# Altium schematic sheet USBHS_TYPEC.SchDoc: USB HS Type-C
size A4; Date: Not used; ApprovedBy: Not used; CheckedBy: Not used; Author: Not used; CompanyName: STMicroelectronics; DrawnBy: Not used; Engineer: Not used; Organization: Not used; Address1: Not used; Address2: Not used; Address3: Not used; Address4: Not used; DocumentNumber: Not used; Revision: Not used; SheetNumber: 9; SheetTotal: 16; CurrentTime: Not used; CurrentDate: Not used; Time: Not used; DocumentFullPathAndName: Not used; DocumentName: Not used; ModifiedDate: Not used; ImagePath: Not used; ProjectName: Not used; Application_BuildNumber: Not used
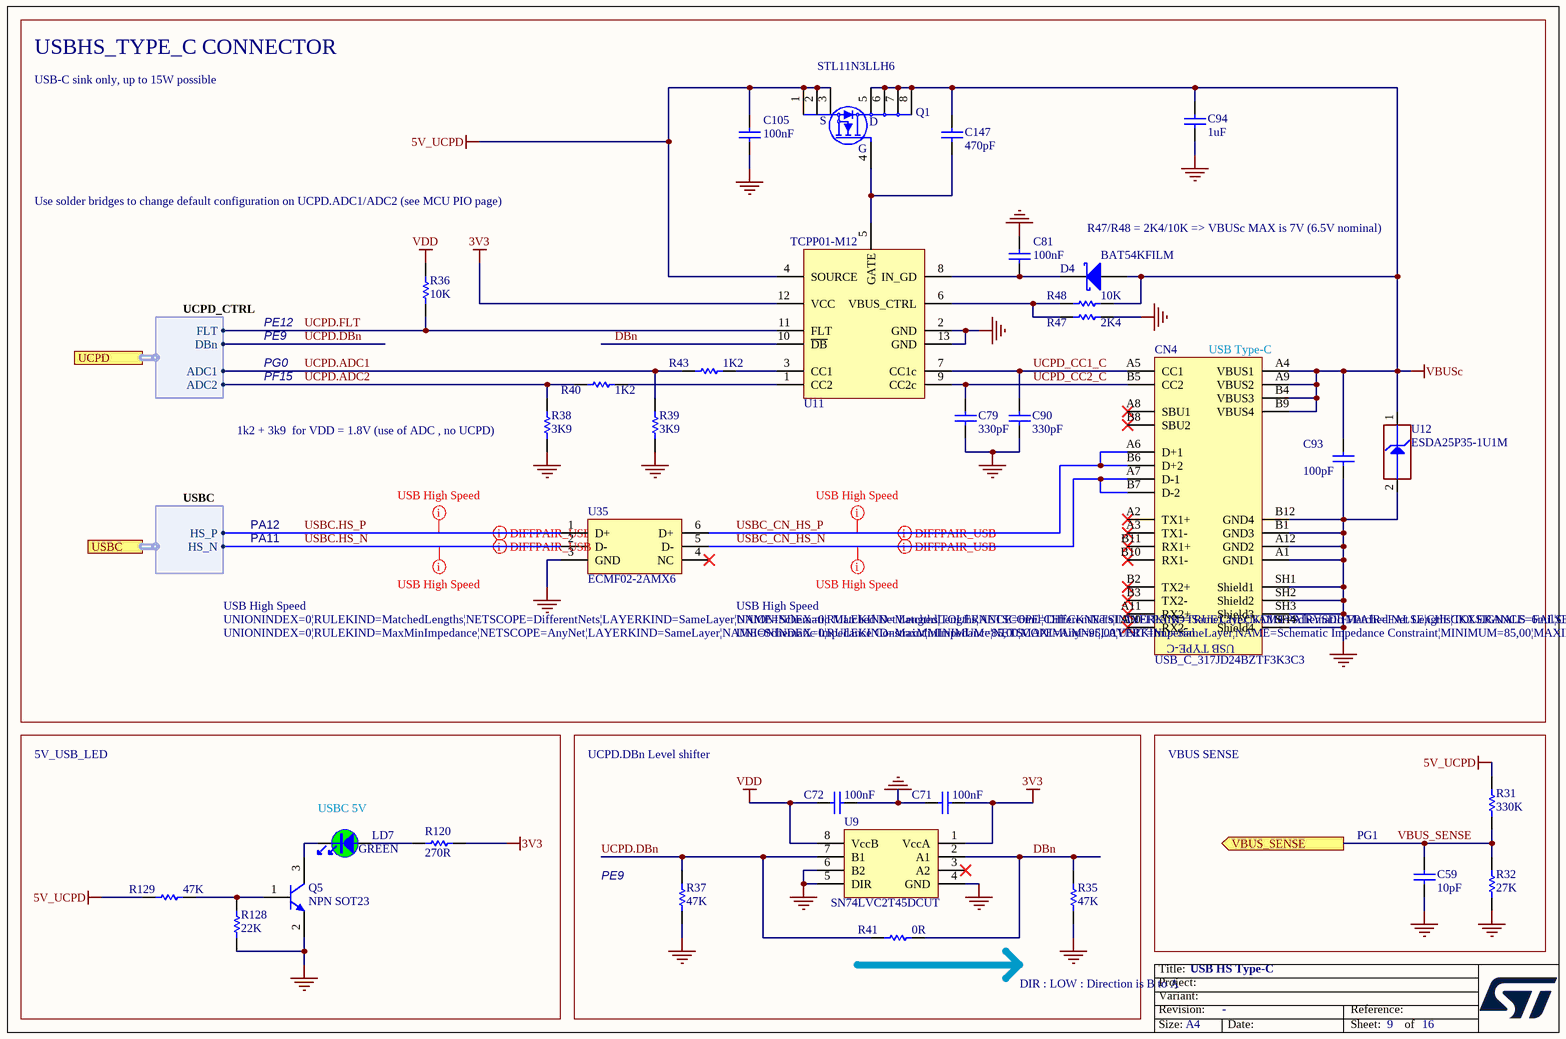
[diagram p0: USBHS_TYPEC.SchDoc]

## Parts
C59  value 10pF  [C0603]  (hidden comment: Capacitor)
C71  value 100nF  [C0402]  (hidden comment: Capacitor)
C72  value 100nF  [C0402]  (hidden comment: Capacitor)
C79  value 330pF  [C0402]  (hidden comment: Capacitor)
C81  value 100nF  [C0603]  (hidden comment: Capacitor)
C90  value 330pF  [C0402]  (hidden comment: Capacitor)
C93  value 100pF  [C0402]  (hidden comment: Capacitor)
C94  value 1uF  [C0402]  (hidden comment: Capacitor)
C105  value 100nF  [C0603]  (hidden comment: Capacitor)
C147  value 470pF  [C0402]  (hidden comment: Capacitor)
CN4  value USB_C_317JD24BZTF3K3C3  [CON_USB-TYPEC_COXOC_317JD24BZTF3K3C3]  (hidden comment: USB_TYPE_C_Receptacle_317JD24BZTF3K3C3)
D4  value BAT54KFILM  [DIO_SOD523_1A_2K]  (hidden comment: SCHOTTKY_1A_2K)
LD7  value GREEN  [LED_0603_OSRAM_LG-Q396-PS-35_GREEN_1A2K_H0P4]  (hidden comment: LED_green)
Q1  STL11N3LLH6  [MOS_POWERFLAT_3P3X3P3_P065]
Q5  value NPN SOT23  [NPN_SOT23]  (hidden comment: 9013-SOT23)
R31  value 330K  [R0603]  (hidden comment: Resistor)
R32  value 27K  [R0603]  (hidden comment: Resistor)
R35  value 47K  [R0603]  (hidden comment: Resistor)
R36  value 10K  [R0603]  (hidden comment: Resistor)
R37  value 47K  [R0603]  (hidden comment: Resistor)
R38  value 3K9  [R0402]  (hidden comment: Resistor)
R39  value 3K9  [R0402]  (hidden comment: Resistor)
R40  value 1K2  [R0402]  (hidden comment: Resistor)
R41  value 0R  [R0402]  (hidden comment: Resistor)
R43  value 1K2  [R0402]  (hidden comment: Resistor)
R47  value 2K4  [R0402]  (hidden comment: Resistor)
R48  value 10K  [R0402]  (hidden comment: Resistor)
R120  value 270R  [R0402]  (hidden comment: Resistor)
R128  value 22K  [R0603]  (hidden comment: Resistor)
R129  value 47K  [R0603]  (hidden comment: Resistor)
U9  SN74LVC2T45DCUT  [ICC_VSSOP8_DCU_R-PDSO-G8_2X2P30_P050]
U11  TCPP01-M12  [ICC_QFN12L-EPAD_3X3_P050]
U12  value ESDA25P35-1U1M  [ESD_QFN1610_2N_1K_2A]  (hidden comment: ESD-TRANSIL)
U35  ECMF02-2AMX6  [ESD_QFN-6L_1P7X1P5_P050]

## Blocks framed on the sheet
USBHS_TYPE_C CONNECTOR: C79 C81 C90 C93 C94 C105 C147 CN4 D4 Q1 R36 R38-R40 R43 R47 R48 U11 U12 U35

## Ports
UCPD (harness UCPD_CTRL), USBC (harness USBC), VBUS_SENSE (out)

## Harnesses
USBC: HS_P, HS_N
UCPD_CTRL: FLT, DBn, ADC1, ADC2

## Nets
3V3: C71.2 R120.2 U9.1(VccA) U11.12(VCC)
5V_UCPD: C105.1 Q1.1(S) Q1.2(S) Q1.3(S) R31.2 R129.1 U11.4(SOURCE)
GND: C59.1 C71.1 C72.2 C79.1 C81.1 C90.1 C93.1 C94.1 C105.2 CN4.A1(GND1) CN4.A12(GND2) CN4.B1(GND3) CN4.B12(GND4) CN4.SH1(Shield1) CN4.SH2(Shield2) CN4.SH3(Shield3) CN4.SH4(Shield4) Q5.2(E) R32.1 R35.1 R37.2 R38.1 R39.1 R47.2 R128.1 U9.4(GND) U9.5(DIR) U9.6(B2) U11.2(GND) U11.13(GND) U12.2(GND) U35.3(GND)
VBUSc: C93.2 C94.2 C147.2 CN4.A4(VBUS1) CN4.A9(VBUS2) CN4.B4(VBUS3) CN4.B9(VBUS4) D4.1(A) Q1.5(D) Q1.6(D) Q1.7(D) Q1.8(D) R48.2 U12.1(IO1)
VDD: C72.1 R36.2 U9.8(VccB)
DBn: R35.2 R41.2 U9.2(A1) U11.10(~{DB})
UCPD.ADC1: R39.2 R43.1 ; port UCPD.ADC1
UCPD.ADC2: R38.2 R40.1 ; port UCPD.ADC2
UCPD.DBn: R37.1 R41.1 U9.7(B1) ; port UCPD.DBn
UCPD.FLT: R36.1 U11.11(FLT) ; port UCPD.FLT
UCPD_CC1_C: C90.2 CN4.A5(CC1) U11.7(CC1c)
UCPD_CC2_C: C79.2 CN4.B5(CC2) U11.9(CC2c)
USBC.HS_N: U35.2(D-) ; port USBC.HS_N
USBC.HS_P: U35.1(D+) ; port USBC.HS_P
USBC_CN_HS_N: CN4.A7(D-1) CN4.B7(D-2) U35.5(D-)
USBC_CN_HS_P: CN4.A6(D+1) CN4.B6(D+2) U35.6(D+)
VBUS_SENSE: C59.2 R31.1 R32.2 ; port VBUS_SENSE
NetC81_2: C81.2 D4.2(K) U11.8(IN_GD)
NetC147_1: C147.1 Q1.4(G) U11.5(GATE)
NetLD7_1: LD7.1 R120.1
NetLD7_2: LD7.2 Q5.3(C)
NetQ5_1: Q5.1(B) R128.2 R129.2
NetR40_2: R40.2 U11.1(CC2)
NetR43_2: R43.2 U11.3(CC1)
NetR47_1: R47.1 R48.1 U11.6(VBUS_CTRL)

Not connected (* = marked no-connect by the designer): CN4 A2(TX1+)* A3(TX1-)* A8(SBU1)* A10(RX2-)* A11(RX2+)* B2(TX2+)* B3(TX2-)* B8(SBU2)* B10(RX1-)* B11(RX1+)*; U9 3(A2)*; U35 4(NC)*

## Layout directives
differential pair; rule Impedance Constraint [Min = 85.00    Max = 95.00    ]: USBC.HS_N, USBC.HS_P, USBC_CN_HS_N, USBC_CN_HS_P
rule Matched Net Lengths [Tolerance = 6mil]; rule Routing Layers [TopLayer - Enabled BottomLayer - Enabled ]; rule Impedance Constraint [Min = 85.00    Max = 95.00    ]; net class USB High Speed: USBC.HS_P, USBC_CN_HS_P
rule Matched Net Lengths [Tolerance = 0mil]; rule Routing Layers [TopLayer - Enabled BottomLayer - Enabled ]; rule Impedance Constraint [Min = 85.00    Max = 95.00    ]; net class USB High Speed: USBC.HS_N, USBC_CN_HS_N

## Notes on the sheet
- USB-C sink only, up to 15W possible
- Use solder bridges to change default configuration on UCPD.ADC1/ADC2 (see MCU PIO page)
- (near D4) R47/R48 = 2K4/10K => VBUSc MAX is 7V (6.5V nominal)
- PG0
- PF15
- PE12
- PE9
- (near CN4) USB Type-C
- (near R38) 1k2 + 3k9  for VDD = 1.8V (use of ADC , no UCPD)
- PA12
- PA11
- 5V_USB_LED
- UCPD.DBn Level shifter
- VBUS SENSE
- (near LD7) USBC 5V
- PG1
- (near R41) DIR : LOW : Direction is B to A
- Title:
- Project:
- Size:
- Revision:
- Variant:
- A4
- -
- Date:
- Reference:
- Sheet:
- of
- (in symbol MCD-01108) USB TYPE-C

## Library data of the parts
C59 = MCD-00637: Capacitor, MLCC, 10pF, 50V, NPO, +/-5%, 0603, T=0.8mm; Manufacturer_Part_Number: CC0603JRNPO9BN100; Manufacturer: YAGEO; Part_Preference: Recommended; Order_Code_RS: 616-9054; Component_Country_Of_Origin: China; Internal_Part_Number: MCD-00637; Status: Released; Part_Type: Capacitor; Package: 0603; ComponentLink1URL: http://tunmcdsvn.tun.st.com/Component_Documentation_Library/Trunk/Capacitor/YAGEO_NP0_Series; Order_Code_Digikey: 311-1058-1-ND; Order_Code_Farnell: 721967
C71 C72 = MCD-00006: Capacitor, MLCC, 100nF, 16V, X7R, +/-10%, 0402, T=0.5mm; Manufacturer_Part_Number: CC0402KRX7R7BB104; Manufacturer: YAGEO; Part_Preference: Recommended; Order_Code_RS: 616-9701; Component_Country_Of_Origin: China; Internal_Part_Number: MCD-00006; Status: Released; Part_Type: Capacitor; Package: 0402; ComponentLink1URL: http://tunmcdsvn.tun.st.com/Component_Documentation_Library/Trunk/Capacitor/YAGEO_X7R_Series; Order_Code_Digikey: 311-1338-1-ND; Order_Code_Farnell: 9402047
C79 C90 = MCD-01579: Capacitor, MLCC, 330pF, 50V, NPO, +/-5%, 0402, T=0.5mm; Manufacturer: YAGEO; Manufacturer_Part_Number: CC0402JRNPO9BN331; Part_Preference: Recommended; Component_Country_Of_Origin: China; Internal_Part_Number: MCD-01579; Status: Checked; Part_Type: Capacitor; Package: 0402; ComponentLink1URL: http://tunmcdsvn.tun.st.com/Component_Documentation_Library/Trunk/Capacitor/YAGEO_NP0_Series; Order_Code_Digikey: 311-1667-1-ND; Order_Code_Farnell: N/A; Order_Code_RS: N/A
C81 C105 = MCD-01099: Capacitor, MLCC, 100nF, 50V, X7R, +/-10%, 0603, T=0.8mm; Manufacturer_Part_Number: CC0603KRX7R9BB104; Manufacturer: YAGEO; BMS_Part_Number: 9142278; Part_Preference: Recommended; Order_Code_RS: 669-8767; Component_Country_Of_Origin: China; Internal_Part_Number: MCD-01099; Status: Released; Part_Type: Capacitor; Package: 0603; ComponentLink1URL: http://tunmcdsvn.tun.st.com/Component_Documentation_Library/Trunk/Capacitor/YAGEO_X7R_Series; Order_Code_Digikey: 311-1344-1-ND; Order_Code_Farnell: 1362556
C93 = MCD-00205: Capacitor, MLCC, 100pF, 50V, NPO, +/-5%, 0402, T=0.5mm; Part_Preference: Recommended; Manufacturer: YAGEO; Manufacturer_Part_Number: CC0402JRNPO9BN101; Component_Country_Of_Origin: China; Internal_Part_Number: MCD-00205; Status: Released; Part_Type: Capacitor; Package: 0402; ComponentLink1URL: http://tunmcdsvn.tun.st.com/Component_Documentation_Library/Trunk/Capacitor/YAGEO_NP0_Series; Order_Code_Digikey: 311-1024-1-ND; Order_Code_Farnell: 3019226RL; Order_Code_RS: N/A
C94 = MCD-02609: Capacitor, MLCC, 1uF, 25V, X5R, +/-10%, 0402, T=0.5mm; Part_Preference: Recommended; Manufacturer: YAGEO; Manufacturer_Part_Number: CC0402KRX5R8BB105; Internal_Part_Number: MCD-02609; Status: New; Part_Type: Capacitor; Package: 0402; ComponentLink1URL: http://tunmcdsvn.tun.st.com/Component_Documentation_Library/Trunk/Capacitor/YAGEO_X5R_Series; Order_Code_Digikey: 311-1698-2-ND; Order_Code_Farnell: 3366440; Order_Code_RS: N/A
C147 = MCD-00724: Capacitor, MLCC, 470pF, 50V, NPO, +/-5%, 0402, T=0.5mm; Part_Preference: Recommended; Manufacturer: YAGEO; Manufacturer_Part_Number: CC0402JRNPO9BN471; Order_Code_RS: 199-2186; Component_Country_Of_Origin: China; Internal_Part_Number: MCD-00724; Status: Released; Part_Type: Capacitor; Package: 0402; ComponentLink1URL: http://tunmcdsvn.tun.st.com/Component_Documentation_Library/Trunk/Capacitor/YAGEO_NP0_Series; Order_Code_Digikey: 311-1671-1-ND; Order_Code_Farnell: 3366416
CN4 = MCD-01108: USB_TypeC, SMD+DIP, T= 2.96mm (for 1.6mm pcb); Part_Type: Connector; Manufacturer: CHANT SINCERE (COXOC); Part_Preference: Recommended; Component_Country_Of_Origin: Unknown; Internal_Part_Number: MCD-01108; Status: Released; Manufacturer_Part_Number: 317JD24BZTF3K3C3; ComponentLink1URL: http://tunmcdsvn.tun.st.com/Component_Documentation_Library/Trunk/Connector/CHANT_SINCERE_(COXOC)_317JD24BZTF3K3C3/; Order_Code_Digikey: N/A; Order_Code_Farnell: N/A; Order_Code_RS: N/A
D4 = MCD-01677: Small signal Schottky diodes; Part_Type: Diode; Manufacturer: STMICROELECTRONICS; BMS_Part_Number: 9151123; Part_Preference: Recommended; Manufacturer_HQ_COO: EU; Component_Country_Of_Origin: China; Internal_Part_Number: MCD-01677; Status: Checked; Manufacturer_Part_Number: BAT54KFILM; Package: SOD-523; ComponentLink1URL: http://tunmcdsvn.tun.st.com/Component_Datasheet_Library/Trunk/Diodes/STM_SCHOTTKY_DOUBLE_BAT54SWFILM/STM_SCHOTTKY_DOUBLE_BAT54SWFILM.pdf
LD7 = MCD-00588: LED Green, 0603 SMD, Forward Voltage Typ=2V, Max=2.5V; Part_Type: Display; Manufacturer_Part_Number: LG Q396-PS-35; Manufacturer: OSRAM OPTO SEMICONDUCTORS; Part_Preference: Recommended; Alternate_Internal_Part_Number: MCD-02400; Component_Country_Of_Origin: Unknown; ShowFields: YES; ID: 3155; Internal_Part_Number: MCD-00588; Status: Released; Package: LED 0603; ComponentLink1URL: http://tunmcdsvn.tun.st.com/Component_Datasheet_Library/Trunk/Display/OSRAM_LED_GREEN_LG Q396-PS-35; Order_Code_Digikey: LG Q396-PS-35-ND
Q1 = MCD-01810: N-channel 30 V, 6 mΩ typ, 11 A STripFET™ H6, Power MOSFET in a PowerFLAT™ 3.3x3.3 package; BMS_Part_Number: 9153561; Part_Type: IC; Part_Preference: Recommended; Manufacturer: STMICROELECTRONICS; Manufacturer_HQ_COO: EU; Component_Country_Of_Origin: China; Internal_Part_Number: MCD-01810; Value: STL11N3LLH6; Status: Released; Manufacturer_Part_Number: STL11N3LLH6; Package: PowerFLAT 3.3x3.3; ComponentLink1URL: http://tunmcdsvn.tun.st.com/Component_Datasheet_Library/Trunk/IC/STM_POWER_MOSFET_STL11N3LLH6
Q5 = MCD-00073: NPN Bipolar Transistor; Part_Type: IC; Manufacturer_Part_Number: BSR14; Manufacturer: ON SEMICONDUCTOR; Part_Preference: Recommended; Component_Country_Of_Origin: Unknown; Revision: *; Internal_Part_Number: MCD-00073; Status: Released; ComponentLink1URL: http://tunmcdsvn.tun.st.com/Component_Datasheet_Library/Trunk/IC/NXP_Transistor_BSR14; Package: SOT23
R31 = MCD-00458: Resistor, 330K, 0603, +/-1%, 1/10W; Manufacturer_Part_Number: RC0603FR-07330KL; Manufacturer: YAGEO; Part_Preference: Recommended; Component_Country_Of_Origin: China; Internal_Part_Number: MCD-00458; Status: Released; Part_Type: Resistor; Package: 0603; ComponentLink1URL: http://tunmcdsvn.tun.st.com/Component_Documentation_Library/Trunk/Resistor/YAGEO_RC_L_Series; Order_Code_Digikey: 311-330KHRCT-ND; Order_Code_Farnell: 9238786; Order_Code_RS: N/A
R32 = MCD-00444: Resistor, 27K, 0603, +/-1%, 1/10W; Manufacturer_Part_Number: RC0603FR-0727KL; Manufacturer: YAGEO; Part_Preference: Recommended; Component_Country_Of_Origin: China; Internal_Part_Number: MCD-00444; Status: Released; Part_Type: Resistor; Package: 0603; ComponentLink1URL: http://tunmcdsvn.tun.st.com/Component_Documentation_Library/Trunk/Resistor/YAGEO_RC_L_Series; Order_Code_Digikey: 311-27.0KHRCT-ND; Order_Code_Farnell: 9238654; Order_Code_RS: N/A
R35 = MCD-00222: Resistor, 47K, 0603, 1%, 1/10W; Part_Preference: Recommended; Manufacturer: YAGEO; Manufacturer_Part_Number: RC0603FR-0747KL; Component_Country_Of_Origin: China; Internal_Part_Number: MCD-00222; Status: Released; Part_Type: Resistor; Package: 0603; ComponentLink1URL: http://tunmcdsvn.tun.st.com/Component_Documentation_Library/Trunk/Resistor/YAGEO_RC_L_Series; Order_Code_Digikey: 311-47.0KHRCT-ND; Order_Code_Farnell: 9238689; Order_Code_RS: N/A
R36 = MCD-00220: Resistor, 10K, 0603, +/-1%, 1/10W; Manufacturer_Part_Number: RC0603FR-0710KL; Manufacturer: YAGEO; Part_Preference: Recommended; Component_Country_Of_Origin: China; Internal_Part_Number: MCD-00220; Status: Released; Part_Type: Resistor; Package: 0603; ComponentLink1URL: http://tunmcdsvn.tun.st.com/Component_Documentation_Library/Trunk/Resistor/YAGEO_RC_L_Series; Order_Code_Digikey: 311-10.0KHRCT-ND; Order_Code_Farnell: 9238603; Order_Code_RS: N/A
R37 R129 = MCD-00222: Resistor, 47K, 0603, 1%, 1/10W; Manufacturer_Part_Number: RC0603FR-0747KL; Manufacturer: YAGEO; Part_Preference: Recommended; Component_Country_Of_Origin: China; Internal_Part_Number: MCD-00222; Status: Released; Part_Type: Resistor; Package: 0603; ComponentLink1URL: http://tunmcdsvn.tun.st.com/Component_Documentation_Library/Trunk/Resistor/YAGEO_RC_L_Series; Order_Code_Digikey: 311-47.0KHRCT-ND; Order_Code_Farnell: 9238689; Order_Code_RS: N/A
R38 R39 = MCD-02455: Resistor, 3K9, 0402, +/-1%, 1/16W, +/-100ppm/°C; Part_Preference: Recommended; Manufacturer: YAGEO; Manufacturer_Part_Number: RC0402FR-073K9L; Order_Code_RS: 198-7783; Component_Country_Of_Origin: China; Internal_Part_Number: MCD-02455; Status: Checked; Part_Type: Resistor; Package: 0402; ComponentLink1URL: http://tunmcdsvn.tun.st.com/Component_Documentation_Library/Trunk/Resistor/YAGEO_RC0402_Series/; Order_Code_Digikey: 311-3.90KLRTR-ND; Order_Code_Farnell: 9239308
R40 R43 = MCD-00373: Resistor, 1K2, 0402, +/-1%, 1/16W; Part_Preference: Recommended; Manufacturer: YAGEO; Manufacturer_Part_Number: RC0402FR-071K2L; Component_Country_Of_Origin: China; Internal_Part_Number: MCD-00373; Status: Released; Part_Type: Resistor; Package: 0402; ComponentLink1URL: http://tunmcdsvn.tun.st.com/Component_Documentation_Library/Trunk/Resistor/YAGEO_RC_L_Series; Order_Code_Digikey: 311-1.20KLRCT-ND; Order_Code_Farnell: 9239243; Order_Code_RS: N/A
R41 = MCD-00052: Resistor, 0R, 0402, +/-5%, 1/16W; Manufacturer_Part_Number: RC0402JR-070RL; Manufacturer: YAGEO; Part_Preference: Recommended; Order_Code_RS: 618-5804; Component_Country_Of_Origin: China; Internal_Part_Number: MCD-00052; Status: Released; Part_Type: Resistor; Package: 0402; ComponentLink1URL: http://tunmcdsvn.tun.st.com/Component_Documentation_Library/Trunk/Resistor/YAGEO_RC_L_Series; Order_Code_Digikey: 311-0.0JRCT-ND; Order_Code_Farnell: 9232516RL
R47 = MCD-00433: Resistor, 2K4, 0402, +/-1%, 1/16W; Part_Preference: Recommended; Manufacturer: YAGEO; Manufacturer_Part_Number: RC0402FR-072K4L; Component_Country_Of_Origin: China; Internal_Part_Number: MCD-00433; Status: Released; Part_Type: Resistor; Package: 0402; ComponentLink1URL: http://tunmcdsvn.tun.st.com/Component_Documentation_Library/Trunk/Resistor/YAGEO_RC_L_Series; Order_Code_Digikey: 311-2.40KLRCT-ND; Order_Code_Farnell: 1458767; Order_Code_RS: N/A
R48 = MCD-00053: Resistor, 10K, 0402, +/-1%, 1/16W; BMS_Part_Number: 9131590; Part_Preference: Recommended; Manufacturer: YAGEO; Manufacturer_Part_Number: RC0402FR-0710KL; Component_Country_Of_Origin: China; Internal_Part_Number: MCD-00053; Status: Released; Part_Type: Resistor; Package: 0402; ComponentLink1URL: http://tunmcdsvn.tun.st.com/Component_Documentation_Library/Trunk/Resistor/YAGEO_RC_L_Series; Order_Code_Digikey: 311-10.0KLRCT-ND; Order_Code_Farnell: 9239359; Order_Code_RS: N/A
R120 = MCD-00441: Resistor, 270R, 0402, +/-1%, 1/16W; Manufacturer: YAGEO; Manufacturer_Part_Number: RC0402FR-07270RL; Part_Preference: Recommended; Component_Country_Of_Origin: China; ShowFields: YES; ID: 2838; Internal_Part_Number: MCD-00441; Status: Released; Part_Type: Resistor; Package: 0402; ComponentLink1URL: http://tunmcdsvn.tun.st.com/Component_Documentation_Library/Trunk/Resistor/YAGEO_RC_L_Series; Order_Code_Digikey: 311-270LRCT-ND; Order_Code_Farnell: 9239162; Order_Code_RS: N/A
R128 = MCD-00430: Resistor, 22K, 0603, +/-1%, 1/10W; Manufacturer_Part_Number: RC0603FR-0722KL; Manufacturer: YAGEO; Part_Preference: Recommended; Component_Country_Of_Origin: China; Internal_Part_Number: MCD-00430; Status: Released; Part_Type: Resistor; Package: 0603; ComponentLink1URL: http://tunmcdsvn.tun.st.com/Component_Documentation_Library/Trunk/Resistor/YAGEO_RC_L_Series; Order_Code_Digikey: 311-22.0KHRCT-ND; Order_Code_Farnell: 9238646; Order_Code_RS: N/A
U9 = MCD-00264: Dual bit dual supply bus transceiver; Part_Type: IC; Manufacturer: TEXAS INSTRUMENTS; BMS_Part_Number: 9169311; Part_Preference: Recommended; Component_Country_Of_Origin: Thailand; Internal_Part_Number: MCD-00264; Value: SN74LVC2T45DCUT; Status: Released; Manufacturer_Part_Number: SN74LVC2T45DCUT; ComponentLink1URL: http://tunmcdsvn.tun.st.com/Component_Datasheet_Library/Trunk/IC/TI_Dual_bit_tranceiver_SN74LVC2T45
U11 = MCD-01809: USB Type-C Port Protection for USB Power Delivery, PPS compliant; Part_Type: IC; Manufacturer: STMICROELECTRONICS; BMS_Part_Number: 9151145; Part_Preference: Recommended; Manufacturer_HQ_COO: EU; Component_Country_Of_Origin: Malaysia; Internal_Part_Number: MCD-01809; Value: TCPP01-M12; Status: Released; Manufacturer_Part_Number: TCPP01-M12; Package: QFN-12L; ComponentLink1URL: http://tunmcdsvn.tun.st.com/Component_Datasheet_Library/Trunk/IC/STM_UCPD_Protection_TCPP01-M12
U12 = MCD-01207: High power Transient voltage suppressor:25V/35A EOS and ESD transients protection.; Part_Type: Diode; Manufacturer: STMICROELECTRONICS; BMS_Part_Number: 9179045; Part_Preference: Recommended; Manufacturer_HQ_COO: EU; Component_Country_Of_Origin: China; Internal_Part_Number: MCD-01207; Status: Released; Manufacturer_Part_Number: ESDA25P35-1U1M; Package: QFN1610; ComponentLink1URL: http://tunmcdsvn.tun.st.com/Component_Datasheet_Library/Trunk/Diodes/STM_ESD_ESDA25P35-1U1M
U35 = MCD-00649: Common mode filter with ESD protection for USB 2.0 interface; Part_Type: Diode; Manufacturer: STMICROELECTRONICS; BMS_Part_Number: 9151138; Part_Preference: Recommended; Manufacturer_HQ_COO: EU; Component_Country_Of_Origin: China; Internal_Part_Number: MCD-00649; Value: ECMF02-2AMX6; Status: Released; Manufacturer_Part_Number: ECMF02-2AMX6; ComponentLink1URL: http://tunmcdsvn.tun.st.com/Component_Datasheet_Library/Trunk/Diodes/STM_ESD_ECMF02-2AMX6